# Altium schematic sheet power.SchDoc
size A3
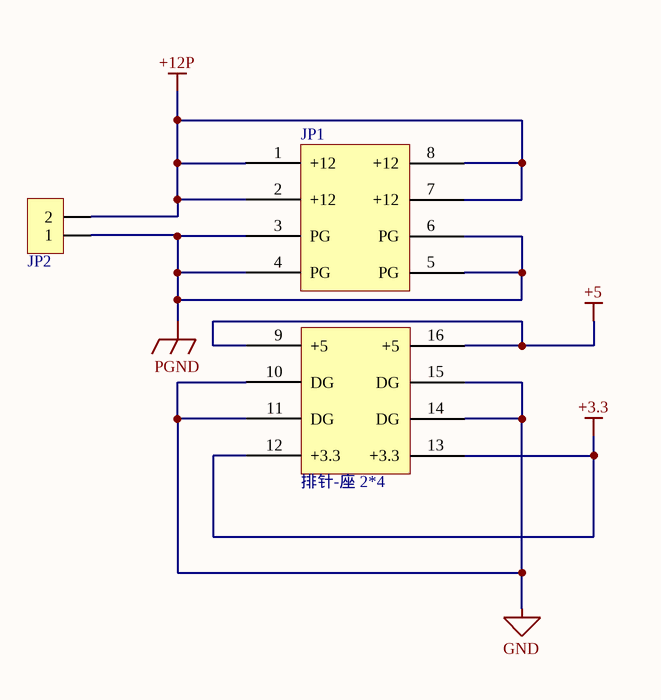
[diagram p0: power.SchDoc]

## Parts
JP1  排针-座 2*4  [排针-座 2*4]
JP2  HDR-1X2  [KF128-5.08-2P]  (value not drawn)

## Nets
+3.3: JP1.12(+3.3) JP1.13(+3.3)
+5: JP1.9(+5) JP1.16(+5)
+12P: JP1.1(+12) JP1.2(+12) JP1.7(+12) JP1.8(+12) JP2.2
GND: JP1.10(DG) JP1.11(DG) JP1.14(DG) JP1.15(DG)
PGND: JP1.3(PG) JP1.4(PG) JP1.5(PG) JP1.6(PG) JP2.1

## Library data of the parts
JP2 = Header 2: 2P接插件; 版权归属: 源创客; BOM名称: 2P接插件; 学习资源: www.ooocke.com